# EAGLE design Matrix Platine (EAGLE 9.2.0)
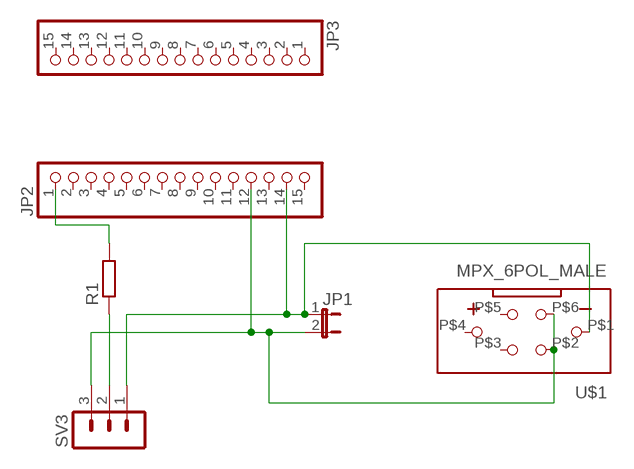
[diagram p0: schematic, sheet 1]

## Parts
JP1  JP1E  [JP1]
JP2  PINHD-1X15  [1X15]
JP3  PINHD-1X15  [1X15]
R1  R-EU_0204/7  [0204/7]
SV3  MA03-1  [MA03-1]
U$1  MPX_6POL_MALE  [MPX_MALE]

## Nets
N$2: JP2.1 R1.2
N$3: JP1.1 JP2.14 SV3.1 U$1.P$1
N$4: JP1.2 JP2.12 SV3.3 U$1.P$2 U$1.P$6
N$6: R1.1 SV3.2
Unconnected: JP2.2 JP2.3 JP2.4 JP2.5 JP2.6 JP2.7 JP2.8 JP2.9 JP2.10 JP2.11 JP2.13 JP2.15 JP3.1 JP3.2 JP3.3 JP3.4 JP3.5 JP3.6 JP3.7 JP3.8 JP3.9 JP3.10 JP3.11 JP3.12 JP3.13 JP3.14 JP3.15 U$1.P$3 U$1.P$4 U$1.P$5

## Library data of the parts
JP1 = jumper:JP1E: JUMPER
JP2 JP3 = pinhead:PINHD-1X15: PIN HEADER
R1 = rcl:R-EU_: RESISTOR, European symbol; SPICEPREFIX: R
SV3 = con-lstb:MA03-1: PIN HEADER; OC_FARNELL: unknown; OC_NEWARK: unknown
U$1 = mpx_plugs:MPX_6POL_MALE: Multiplex Germany plug male/Stecker 6pin, max. 10A/Pin

## Board
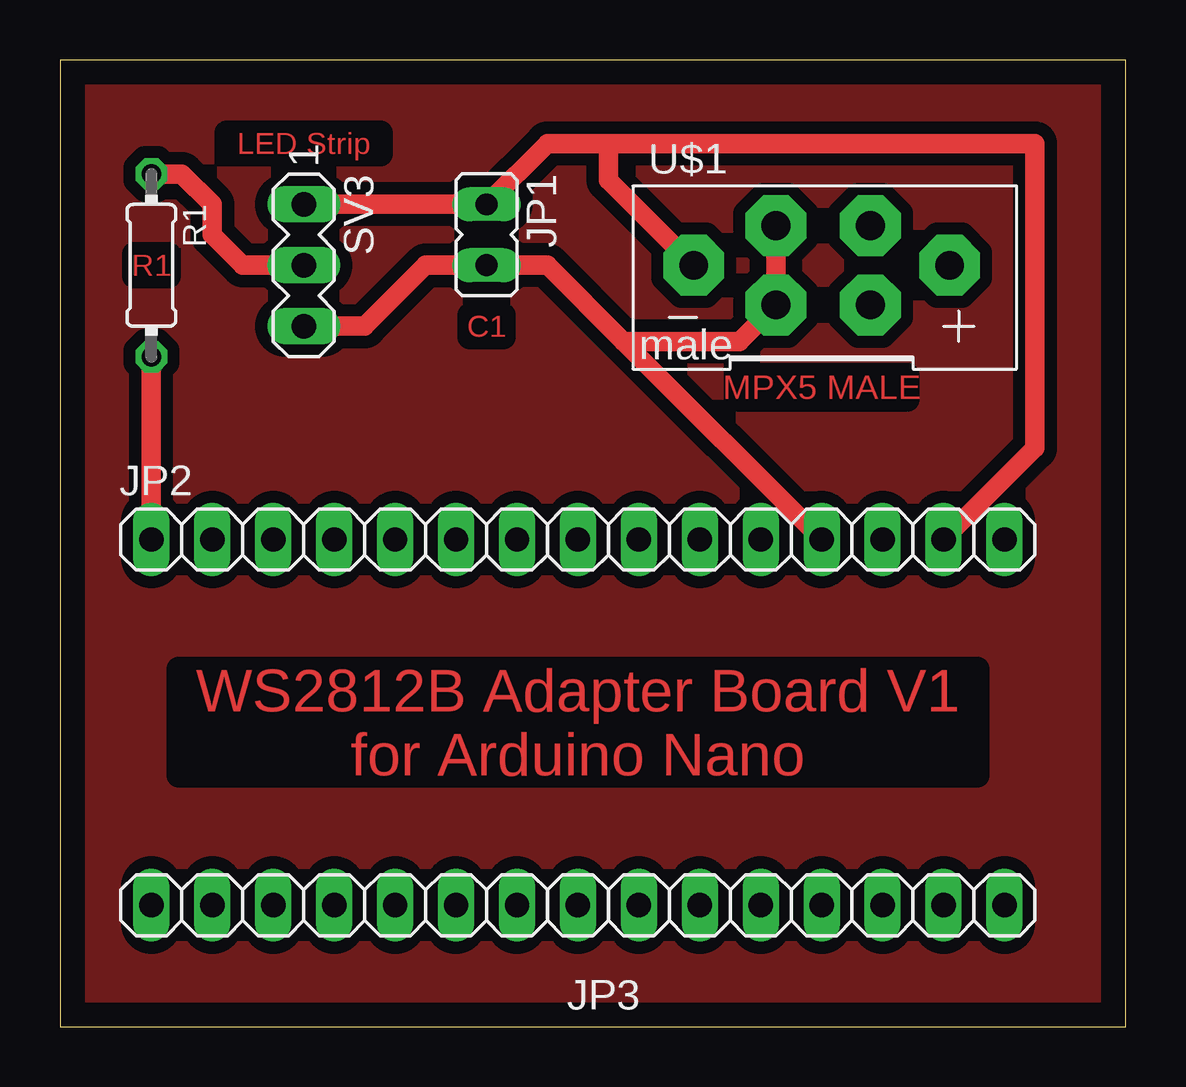
[diagram p1: board, top side]

Size 44.43 x 40.31 mm. Coordinates in mm from the lower left corner, seen from the top.
Outline: 0,0 44.43,0 44.43,40.31 0,40.31 0,0
Copper layers (1*16): Top 0.035mm / dielectric 1.5mm / Bottom 0.035mm
Design rules "default": minimum track width 6mil, minimum drill 0.35mm, track to track 6mil, track to pad 6mil, pad to pad 6mil, via to via 6mil, smd to smd 6mil, copper to edge 40mil, drill to drill 6mil, minimum pad ring 10mil, minimum via ring 8mil, stop-mask expansion 4mil, vias tented up to drill 0mil, thermal gap 10mil

### Footprints (pad centres in the part's own frame; a part is rotated, then mirrored left to right if it is on the bottom)
JP1 = drill 0.914 long: 1 0,-1.27; 2 0,1.27
1X15 = drill 1.016 long: 1 -17.78,0; 2 -15.24,0; 3 -12.7,0; 4 -10.16,0; 5 -7.62,0; 6 -5.08,0; 7 -2.54,0; 8 0,0; 9 2.54,0; 10 5.08,0; 11 7.62,0; 12 10.16,0; 13 12.7,0; 14 15.24,0; 15 17.78,0
0204/7 = drill 0.813 octagon: 1 -3.81,0; 2 3.81,0
MA03-1 = drill 1.016 long: 1 -2.54,0; 2 0,0; 3 2.54,0
MPX_MALE = drill 1.2 pad 2.54 octagon: P$1 -5.334,0; P$2 -1.905,1.651; P$3 2.032,1.651; P$4 5.334,0; P$5 2.032,-1.651; P$6 -1.905,-1.651

### Placement (x,y rotation side)
JP1  17.78,33.02 180 top
JP2  21.59,20.32 0 top
JP3  21.59,5.08 180 top
R1  3.81,31.75 270 top
SV3  10.16,31.75 270 top
U$1  31.75,31.75 0 top

### Tracks (layer width: path | path; a pad name or v marks a point on that pad's centre or on a via)
GND
  pour Top (isolate 0.508): 0,40.64 44.45,40.64 44.45,0 0,0
N$2
  Top 0.813: JP2.1 R1.2
N$3
  Top 0.813: SV3.1 JP1.1 20.32,36.83 22.86,36.83 | 22.86,36.83 40.64,36.83 40.64,24.13 JP2.14 | U$1.P$1 22.86,35.31 22.86,36.83
N$4
  Top 0.813: 23.49,28.57 20.32,31.75 JP1.2 15.24,31.75 12.7,29.21 SV3.3 | 23.49,28.57 JP2.12 | U$1.P$2 U$1.P$6 28.32,28.57 23.49,28.57
N$6
  Top 0.813: R1.1 5.08,35.56 6.35,34.29 6.35,33.02 7.62,31.75 SV3.2

### Text on the board
Top: LED Strip | R1 | C1 | MPX5 MALE | WS2812B Adapter Board V1 / for Arduino Nano